# Altium schematic sheet CAN-IO.SchDoc
size A4; DrawnBy: Emile Renaud; Revision: V1; SheetNumber: 1; SheetTotal: 3
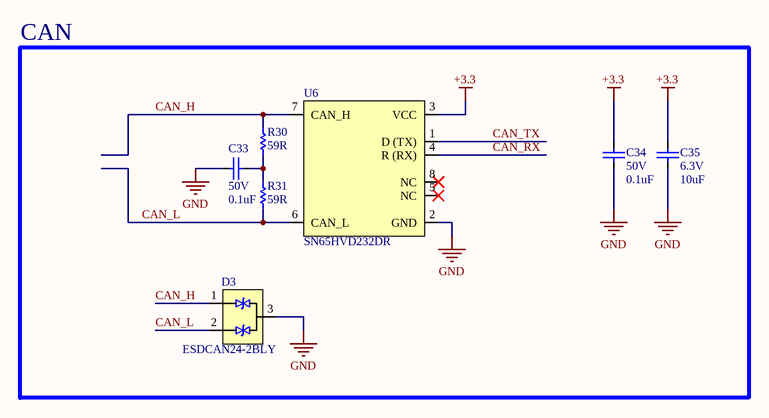
[diagram p0: CAN-IO.SchDoc]

## Parts
C33  value 0.1uF  Volt: 50V  [CAPACITOR-0603]  (hidden comment: Capacitor-0603-0.1uF-50V-X7R)
C34  value 0.1uF  Volt: 50V  [CAPACITOR-0603]  (hidden comment: Capacitor-0603-0.1uF-50V-X7R)
C35  value 10uF  Volt: 6.3V  [CAPACITOR-0603]  (hidden comment: Capacitor-0603-10uF-6.3V-X5R)
D3  ESDCAN24-2BLY  [SOT-23-3]
R30  value 59R  [Resistor-0603]  (hidden comment: SMT resistor)
R31  value 59R  [Resistor-0603]  (hidden comment: SMT resistor)
U6  SN65HVD232DR  [SOIC-8]

## Blocks framed on the sheet
CAN: C33-C35 D3 R30 R31 U6

## Nets
+3.3: C34.2 C35.2 U6.3(VCC)
GND: C33.1 C34.1 C35.1 D3.3(L3) U6.2(GND)
CAN_H: D3.1(L2) R30.2 U6.7(CAN_H)
CAN_L: D3.2(GND) R31.1 U6.6(CAN_L)
CAN_RX: U6.4(R_(RX))
CAN_TX: U6.1(D_(TX))
NetC33_2: C33.2 R30.1 R31.2

Not connected (* = marked no-connect by the designer): U6 5(NC)* 8(NC)*

## Notes on the sheet
- Title:
- Date:
- Size:
- B
- Drawn by:
- Checked by:
- Sheet
- of
- Revision:
- File:

## Library data of the parts
C33 C34 = Capacitor-0603-0.1uF-50V-X7R: Precision: X7R-10%; Package / Case: Metric 1608, EIA 0603; Mounted: Yes; Supplier 1: Digi-Key; Supplier Part Number 1: 1276-1935-2-ND; Supplier 2: Digi-Key; Supplier Part Number 2: 1276-1934-2-ND
C35 = Capacitor-0603-10uF-6.3V-X5R: Capacitor-0603-10uF-6.3V-X5R, Low ESR, Low ESL; Precision: X5R-20%; Supplier 1: Arrow Electronics; Supplier Part Number 1: NMC0603X5R106M6.3TRP4KF; Mounted: Yes; Package / Case: Metric 1608 , EIA 0603
D3 = ESDCAN24-2BLY: 55V Clamp 6A (8/20µs) Ipp Tvs Diode Surface Mount SOT-23; Volt: 24; Supplier 1: Digi-Key; Supplier Part Number 1: 5272-ESDCAN24-2BLYCT-ND; Mounted: Yes; Package / Case: SOT-23-3
R30 R31 = Resistor-0603-59R: Resistor0603-59R; Precision: 1%; Watt: 0.1W; Mounted: Yes; Package / Case: Metric 1608, EIA 0603; Supplier 1: Digi-Key; Supplier Part Number 1: 311-59.0HRCT-ND
U6 = SN65HVD232DR: 1/1 Transceiver Half CANbus 8-SOIC; Package / Case: 8-SOIC; Mounted: Yes; Supplier 1: Digikey; Supplier Part Number 1: 296-26344-1-ND; HelpURL: https://www.ti.com/lit/ds/symlink/sn65hvd230.pdf?HQS=dis-dk-null-digikeymode-dsf-pf-null-wwe&ts=1723930967656&ref_url=https%253A%252F%252Fwww.ti.com%252Fgeneral%252Fdocs%252Fsuppproductinfo.tsp%253FdistId%253D10%2526gotoUrl%253Dhttps%253A%252F%252Fwww.ti.com%252Flit%252Fgpn%252Fsn65hvd230